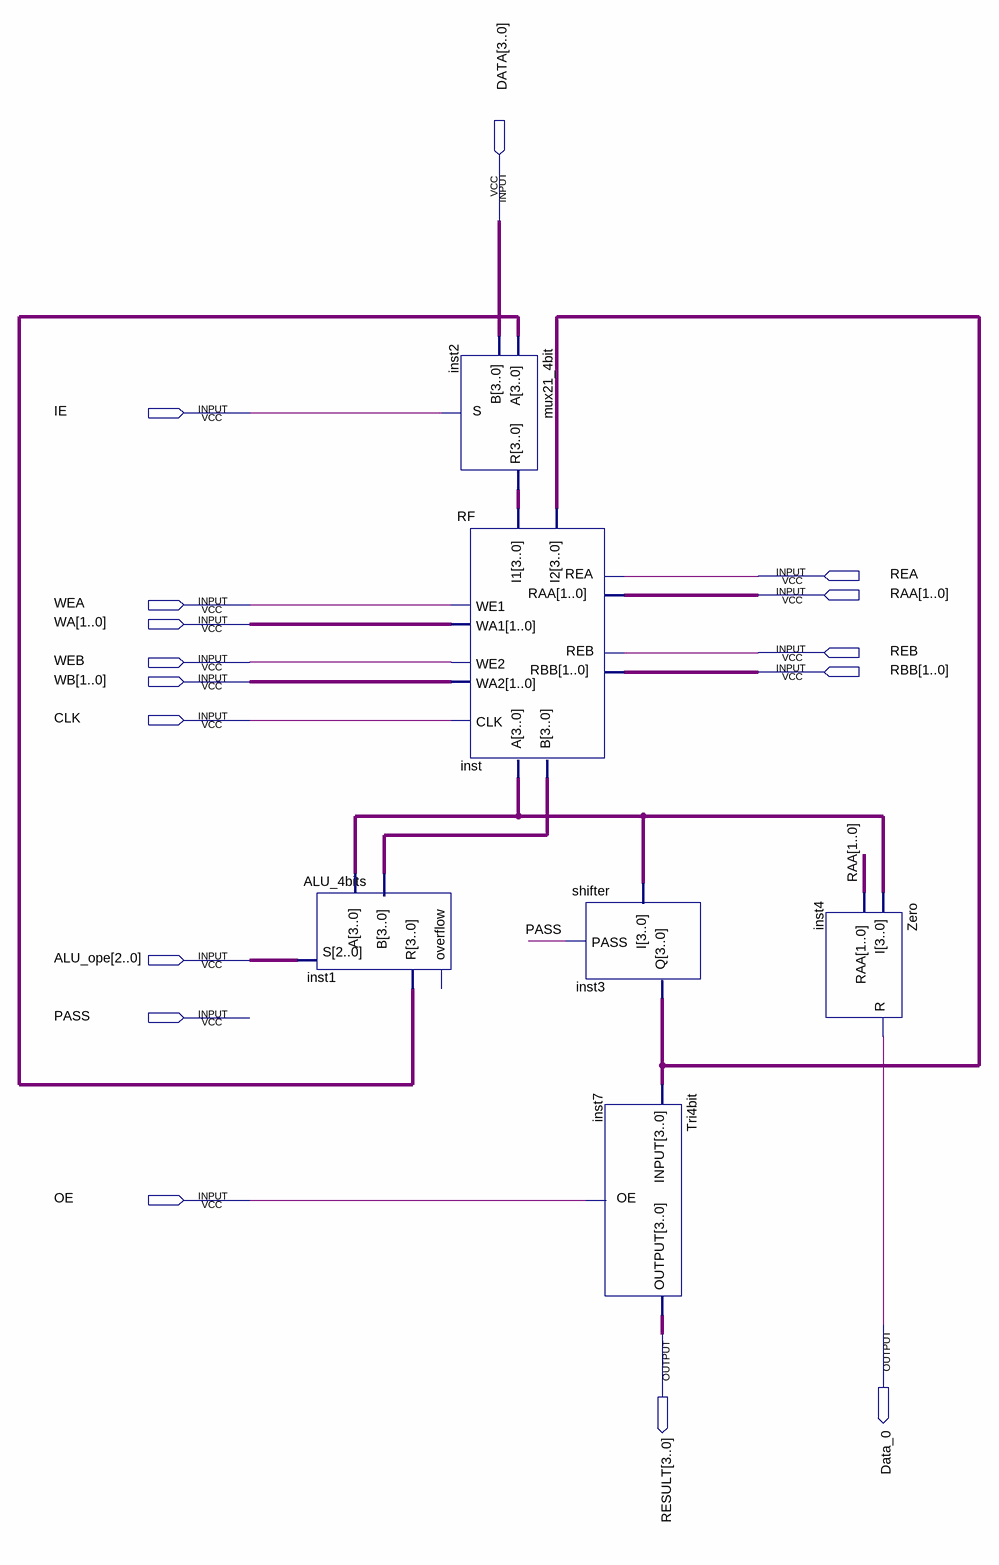
[diagram p0: schematic sheet]
// Quartus schematic parallel_datapath.bdf as structural Verilog: 6 symbols, 16 pins
module parallel_datapath (
  input  [3:0] DATA,
  input  IE,
  input  REA,
  input  [1:0] RAA,
  input  WEA,
  input  [1:0] WA,
  input  REB,
  input  WEB,
  input  [1:0] RBB,
  input  [1:0] WB,
  input  CLK,
  input  [2:0] ALU_ope,
  input  PASS,
  input  OE,
  output Data_0,
  output [3:0] RESULT
);

  wire [3:0] inst1_r, inst2_r, inst3_q, inst_a, inst_b;

  ALU_4bits inst1 (.A(inst_a), .B(inst_b), .S(ALU_ope), .R(inst1_r));  // open: overflow
  mux21_4bit inst2 (.A(inst1_r), .B(DATA), .S(IE), .R(inst2_r));
  RF inst (
    .I1(inst2_r), .I2(inst3_q), .REA(REA), .RAA(RAA), .WE1(WEA), .WA1(WA), .REB(REB), .WE2(WEB), .RBB(RBB),
    .WA2(WB), .CLK(CLK), .A(inst_a), .B(inst_b));
  shifter inst3 (.I(inst_a), .PASS(PASS), .Q(inst3_q));
  Tri4bit inst7 (.INPUT(inst3_q), .OE(OE), .OUTPUT(RESULT));
  Zero inst4 (.I(inst_a), .RAA(RAA), .R(Data_0));
endmodule
